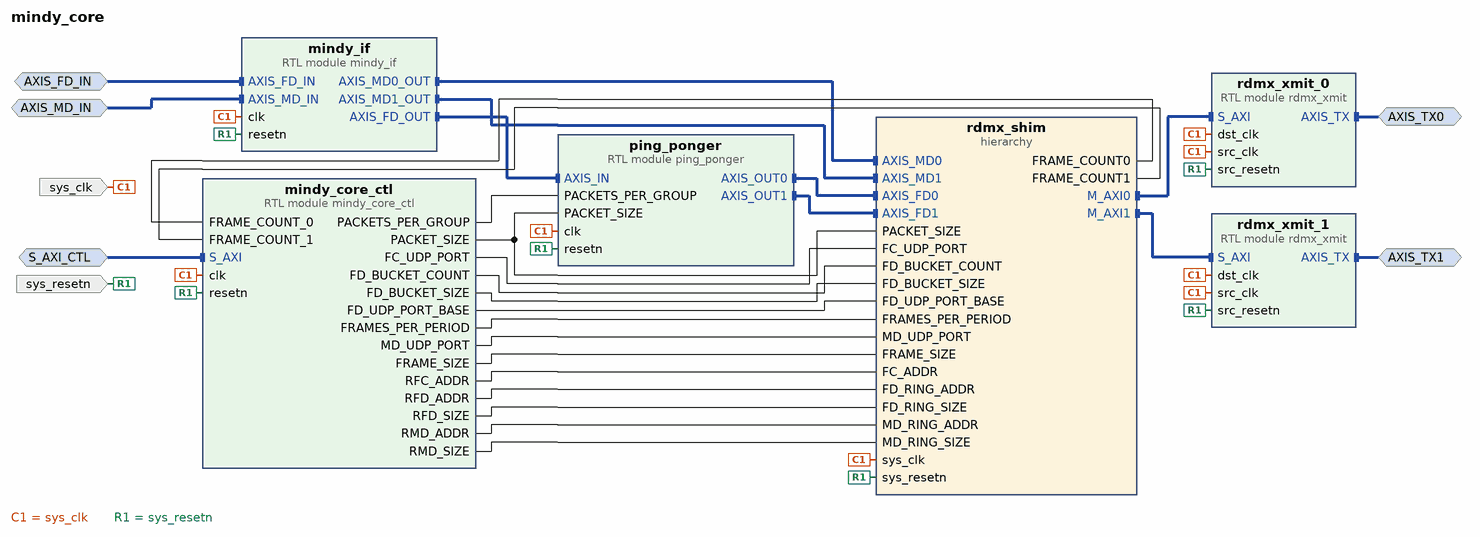
[diagram p0: block diagram of the top level]
# Vivado block design mindy_core, xcvp1202-vsva2785-2MP-e-S, Vivado 2024.2
create_bd_design mindy_core

create_bd_intf_port -mode Slave -vlnv xilinx.com:interface:axis_rtl:1.0 AXIS_FD_IN
set_property -dict [list \
  CONFIG.FREQ_HZ 250000000 \
  CONFIG.HAS_TKEEP 0 \
  CONFIG.HAS_TLAST 0 \
  CONFIG.HAS_TREADY 1 \
  CONFIG.HAS_TSTRB 0 \
  CONFIG.LAYERED_METADATA undef \
  CONFIG.TDATA_NUM_BYTES 64 \
  CONFIG.TDEST_WIDTH 0 \
  CONFIG.TID_WIDTH 0 \
  CONFIG.TUSER_WIDTH 0 \
] [get_bd_intf_ports AXIS_FD_IN]
create_bd_intf_port -mode Slave -vlnv xilinx.com:interface:aximm_rtl:1.0 S_AXI_CTL
set_property -dict [list \
  CONFIG.ADDR_WIDTH 32 \
  CONFIG.ARUSER_WIDTH 0 \
  CONFIG.AWUSER_WIDTH 0 \
  CONFIG.BUSER_WIDTH 0 \
  CONFIG.DATA_WIDTH 32 \
  CONFIG.FREQ_HZ 250000000 \
  CONFIG.HAS_BRESP 1 \
  CONFIG.HAS_BURST 0 \
  CONFIG.HAS_CACHE 0 \
  CONFIG.HAS_LOCK 0 \
  CONFIG.HAS_PROT 1 \
  CONFIG.HAS_QOS 0 \
  CONFIG.HAS_REGION 0 \
  CONFIG.HAS_RRESP 1 \
  CONFIG.HAS_WSTRB 1 \
  CONFIG.ID_WIDTH 0 \
  CONFIG.NUM_READ_OUTSTANDING 1 \
  CONFIG.NUM_READ_THREADS 1 \
  CONFIG.NUM_WRITE_OUTSTANDING 1 \
  CONFIG.NUM_WRITE_THREADS 1 \
  CONFIG.PROTOCOL AXI4LITE \
  CONFIG.READ_WRITE_MODE READ_WRITE \
  CONFIG.RUSER_BITS_PER_BYTE 0 \
  CONFIG.RUSER_WIDTH 0 \
  CONFIG.WUSER_BITS_PER_BYTE 0 \
  CONFIG.WUSER_WIDTH 0 \
] [get_bd_intf_ports S_AXI_CTL]
create_bd_intf_port -mode Master -vlnv xilinx.com:interface:axis_rtl:1.0 AXIS_TX0
set_property -dict {CONFIG.FREQ_HZ 250000000} [get_bd_intf_ports AXIS_TX0]
create_bd_intf_port -mode Master -vlnv xilinx.com:interface:axis_rtl:1.0 AXIS_TX1
set_property -dict {CONFIG.FREQ_HZ 250000000} [get_bd_intf_ports AXIS_TX1]
create_bd_intf_port -mode Slave -vlnv xilinx.com:interface:axis_rtl:1.0 AXIS_MD_IN
set_property -dict [list \
  CONFIG.FREQ_HZ 250000000 \
  CONFIG.HAS_TKEEP 0 \
  CONFIG.HAS_TLAST 0 \
  CONFIG.HAS_TREADY 1 \
  CONFIG.HAS_TSTRB 0 \
  CONFIG.LAYERED_METADATA undef \
  CONFIG.TDATA_NUM_BYTES 64 \
  CONFIG.TDEST_WIDTH 0 \
  CONFIG.TID_WIDTH 0 \
  CONFIG.TUSER_WIDTH 0 \
] [get_bd_intf_ports AXIS_MD_IN]
create_bd_port -dir I sys_resetn
create_bd_port -dir I -type clk sys_clk
set_property -dict [list \
  CONFIG.ASSOCIATED_BUSIF AXIS_FD_IN:S_AXI_CTL:AXIS_MD_IN:AXIS_TX0:AXIS_TX1 \
  CONFIG.FREQ_HZ 250000000 \
] [get_bd_ports sys_clk]

create_bd_cell -type hier rdmx_shim
create_bd_cell -type module -reference ping_ponger ping_ponger
create_bd_cell -type module -reference mindy_if mindy_if
create_bd_cell -type module -reference mindy_core_ctl mindy_core_ctl
create_bd_cell -type module -reference rdmx_xmit rdmx_xmit_0
set_property -dict {CONFIG.FIFO_CLOCK_MODE common_clock CONFIG.SRC_MAC 0} [get_bd_cells rdmx_xmit_0]
create_bd_cell -type module -reference rdmx_xmit rdmx_xmit_1
set_property -dict {CONFIG.FIFO_CLOCK_MODE common_clock CONFIG.SRC_MAC 1} [get_bd_cells rdmx_xmit_1]

# ---- hierarchy /rdmx_shim ----
current_bd_instance /rdmx_shim
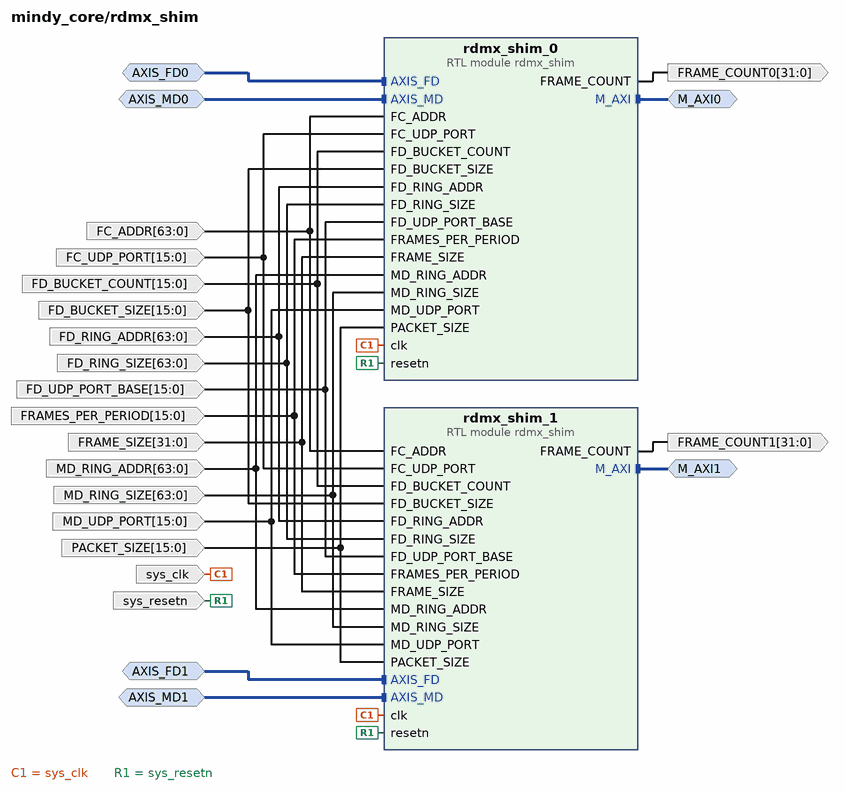
[diagram p1: block diagram inside /rdmx_shim]
create_bd_intf_pin -mode Slave -vlnv xilinx.com:interface:axis_rtl:1.0 AXIS_FD1
create_bd_intf_pin -mode Slave -vlnv xilinx.com:interface:axis_rtl:1.0 AXIS_MD1
create_bd_intf_pin -mode Master -vlnv xilinx.com:interface:aximm_rtl:1.0 M_AXI1
create_bd_intf_pin -mode Slave -vlnv xilinx.com:interface:axis_rtl:1.0 AXIS_FD0
create_bd_intf_pin -mode Slave -vlnv xilinx.com:interface:axis_rtl:1.0 AXIS_MD0
create_bd_intf_pin -mode Master -vlnv xilinx.com:interface:aximm_rtl:1.0 M_AXI0
create_bd_pin -dir I sys_clk
create_bd_pin -dir I sys_resetn
create_bd_pin -dir O -from 31 -to 0 FRAME_COUNT1
create_bd_pin -dir I -from 15 -to 0 PACKET_SIZE
create_bd_pin -dir I -from 31 -to 0 FRAME_SIZE
create_bd_pin -dir I -from 63 -to 0 FD_RING_ADDR
create_bd_pin -dir I -from 63 -to 0 FD_RING_SIZE
create_bd_pin -dir I -from 63 -to 0 MD_RING_ADDR
create_bd_pin -dir I -from 63 -to 0 MD_RING_SIZE
create_bd_pin -dir I -from 63 -to 0 FC_ADDR
create_bd_pin -dir O -from 31 -to 0 FRAME_COUNT0
create_bd_pin -dir I -from 15 -to 0 MD_UDP_PORT
create_bd_pin -dir I -from 15 -to 0 FC_UDP_PORT
create_bd_pin -dir I -from 15 -to 0 FD_UDP_PORT_BASE
create_bd_pin -dir I -from 15 -to 0 FRAMES_PER_PERIOD
create_bd_pin -dir I -from 15 -to 0 FD_BUCKET_COUNT
create_bd_pin -dir I -from 15 -to 0 FD_BUCKET_SIZE

create_bd_cell -type module -reference rdmx_shim rdmx_shim_1
create_bd_cell -type module -reference rdmx_shim rdmx_shim_0

# ---- connections ----

current_bd_instance /rdmx_shim
connect_bd_intf_net -intf_net AXIS_FD0_1 [get_bd_intf_pins AXIS_FD0] [get_bd_intf_pins rdmx_shim_0/AXIS_FD]
connect_bd_intf_net -intf_net AXIS_FD1_1 [get_bd_intf_pins AXIS_FD1] [get_bd_intf_pins rdmx_shim_1/AXIS_FD]
connect_bd_intf_net -intf_net AXIS_MD0_1 [get_bd_intf_pins AXIS_MD0] [get_bd_intf_pins rdmx_shim_0/AXIS_MD]
connect_bd_intf_net -intf_net AXIS_MD1_1 [get_bd_intf_pins AXIS_MD1] [get_bd_intf_pins rdmx_shim_1/AXIS_MD]
connect_bd_intf_net [get_bd_intf_pins M_AXI0] [get_bd_intf_pins rdmx_shim_0/M_AXI]
connect_bd_intf_net [get_bd_intf_pins M_AXI1] [get_bd_intf_pins rdmx_shim_1/M_AXI]
connect_bd_net [get_bd_pins FC_ADDR] [get_bd_pins rdmx_shim_0/FC_ADDR] [get_bd_pins rdmx_shim_1/FC_ADDR]
connect_bd_net [get_bd_pins FC_UDP_PORT] [get_bd_pins rdmx_shim_0/FC_UDP_PORT] [get_bd_pins rdmx_shim_1/FC_UDP_PORT]
connect_bd_net [get_bd_pins FD_BUCKET_COUNT] [get_bd_pins rdmx_shim_0/FD_BUCKET_COUNT] [get_bd_pins rdmx_shim_1/FD_BUCKET_COUNT]
connect_bd_net [get_bd_pins FD_BUCKET_SIZE] [get_bd_pins rdmx_shim_0/FD_BUCKET_SIZE] [get_bd_pins rdmx_shim_1/FD_BUCKET_SIZE]
connect_bd_net [get_bd_pins FD_RING_ADDR] [get_bd_pins rdmx_shim_0/FD_RING_ADDR] [get_bd_pins rdmx_shim_1/FD_RING_ADDR]
connect_bd_net [get_bd_pins FD_RING_SIZE] [get_bd_pins rdmx_shim_0/FD_RING_SIZE] [get_bd_pins rdmx_shim_1/FD_RING_SIZE]
connect_bd_net [get_bd_pins FD_UDP_PORT_BASE] [get_bd_pins rdmx_shim_0/FD_UDP_PORT_BASE] [get_bd_pins rdmx_shim_1/FD_UDP_PORT_BASE]
connect_bd_net [get_bd_pins FRAMES_PER_PERIOD] [get_bd_pins rdmx_shim_0/FRAMES_PER_PERIOD] [get_bd_pins rdmx_shim_1/FRAMES_PER_PERIOD]
connect_bd_net [get_bd_pins FRAME_SIZE] [get_bd_pins rdmx_shim_0/FRAME_SIZE] [get_bd_pins rdmx_shim_1/FRAME_SIZE]
connect_bd_net [get_bd_pins MD_RING_ADDR] [get_bd_pins rdmx_shim_0/MD_RING_ADDR] [get_bd_pins rdmx_shim_1/MD_RING_ADDR]
connect_bd_net [get_bd_pins MD_RING_SIZE] [get_bd_pins rdmx_shim_0/MD_RING_SIZE] [get_bd_pins rdmx_shim_1/MD_RING_SIZE]
connect_bd_net [get_bd_pins MD_UDP_PORT] [get_bd_pins rdmx_shim_0/MD_UDP_PORT] [get_bd_pins rdmx_shim_1/MD_UDP_PORT]
connect_bd_net [get_bd_pins PACKET_SIZE] [get_bd_pins rdmx_shim_0/PACKET_SIZE] [get_bd_pins rdmx_shim_1/PACKET_SIZE]
connect_bd_net [get_bd_pins rdmx_shim_0/FRAME_COUNT] [get_bd_pins FRAME_COUNT0]
connect_bd_net [get_bd_pins rdmx_shim_1/FRAME_COUNT] [get_bd_pins FRAME_COUNT1]
connect_bd_net [get_bd_pins sys_clk] [get_bd_pins rdmx_shim_0/clk] [get_bd_pins rdmx_shim_1/clk]
connect_bd_net [get_bd_pins sys_resetn] [get_bd_pins rdmx_shim_0/resetn] [get_bd_pins rdmx_shim_1/resetn]

current_bd_instance /
connect_bd_intf_net [get_bd_intf_pins mindy_if/AXIS_FD_IN] [get_bd_intf_ports AXIS_FD_IN]
connect_bd_intf_net [get_bd_intf_pins mindy_if/AXIS_MD_IN] [get_bd_intf_ports AXIS_MD_IN]
connect_bd_intf_net [get_bd_intf_pins mindy_core_ctl/S_AXI] [get_bd_intf_ports S_AXI_CTL]
connect_bd_intf_net [get_bd_intf_pins mindy_if/AXIS_FD_OUT] [get_bd_intf_pins ping_ponger/AXIS_IN]
connect_bd_intf_net [get_bd_intf_pins mindy_if/AXIS_MD0_OUT] [get_bd_intf_pins rdmx_shim/AXIS_MD0]
connect_bd_intf_net [get_bd_intf_pins mindy_if/AXIS_MD1_OUT] [get_bd_intf_pins rdmx_shim/AXIS_MD1]
connect_bd_intf_net -intf_net ping_ponger_0_AXIS_OUT0 [get_bd_intf_pins ping_ponger/AXIS_OUT0] [get_bd_intf_pins rdmx_shim/AXIS_FD0]
connect_bd_intf_net -intf_net ping_ponger_0_AXIS_OUT1 [get_bd_intf_pins ping_ponger/AXIS_OUT1] [get_bd_intf_pins rdmx_shim/AXIS_FD1]
connect_bd_intf_net [get_bd_intf_pins rdmx_xmit_0/S_AXI] [get_bd_intf_pins rdmx_shim/M_AXI0]
connect_bd_intf_net [get_bd_intf_pins rdmx_xmit_1/S_AXI] [get_bd_intf_pins rdmx_shim/M_AXI1]
connect_bd_intf_net [get_bd_intf_pins rdmx_xmit_0/AXIS_TX] [get_bd_intf_ports AXIS_TX0]
connect_bd_intf_net [get_bd_intf_pins rdmx_xmit_1/AXIS_TX] [get_bd_intf_ports AXIS_TX1]
connect_bd_net -net FC_UDP_PORT_1 [get_bd_pins mindy_core_ctl/FC_UDP_PORT] [get_bd_pins rdmx_shim/FC_UDP_PORT]
connect_bd_net -net FD_BUCKET_COUNT_1 [get_bd_pins mindy_core_ctl/FD_BUCKET_COUNT] [get_bd_pins rdmx_shim/FD_BUCKET_COUNT]
connect_bd_net -net FD_BUCKET_SIZE_1 [get_bd_pins mindy_core_ctl/FD_BUCKET_SIZE] [get_bd_pins rdmx_shim/FD_BUCKET_SIZE]
connect_bd_net -net FD_UDP_PORT_BASE_1 [get_bd_pins mindy_core_ctl/FD_UDP_PORT_BASE] [get_bd_pins rdmx_shim/FD_UDP_PORT_BASE]
connect_bd_net -net FRAMES_PER_PERIOD_1 [get_bd_pins mindy_core_ctl/FRAMES_PER_PERIOD] [get_bd_pins rdmx_shim/FRAMES_PER_PERIOD]
connect_bd_net -net MD_UDP_PORT_1 [get_bd_pins mindy_core_ctl/MD_UDP_PORT] [get_bd_pins rdmx_shim/MD_UDP_PORT]
connect_bd_net -net mindy_core_ctl_0_FRAME_SIZE [get_bd_pins mindy_core_ctl/FRAME_SIZE] [get_bd_pins rdmx_shim/FRAME_SIZE]
connect_bd_net -net mindy_core_ctl_0_PACKET_SIZE [get_bd_pins mindy_core_ctl/PACKET_SIZE] \
  [get_bd_pins rdmx_shim/PACKET_SIZE] [get_bd_pins ping_ponger/PACKET_SIZE]
connect_bd_net -net mindy_core_ctl_0_RFC_ADDR [get_bd_pins mindy_core_ctl/RFC_ADDR] [get_bd_pins rdmx_shim/FC_ADDR]
connect_bd_net -net mindy_core_ctl_0_RFD_ADDR [get_bd_pins mindy_core_ctl/RFD_ADDR] [get_bd_pins rdmx_shim/FD_RING_ADDR]
connect_bd_net -net mindy_core_ctl_0_RFD_SIZE [get_bd_pins mindy_core_ctl/RFD_SIZE] [get_bd_pins rdmx_shim/FD_RING_SIZE]
connect_bd_net -net mindy_core_ctl_0_RMD_ADDR [get_bd_pins mindy_core_ctl/RMD_ADDR] [get_bd_pins rdmx_shim/MD_RING_ADDR]
connect_bd_net -net mindy_core_ctl_0_RMD_SIZE [get_bd_pins mindy_core_ctl/RMD_SIZE] [get_bd_pins rdmx_shim/MD_RING_SIZE]
connect_bd_net [get_bd_pins mindy_core_ctl/PACKETS_PER_GROUP] [get_bd_pins ping_ponger/PACKETS_PER_GROUP]
connect_bd_net [get_bd_pins rdmx_shim/FRAME_COUNT0] [get_bd_pins mindy_core_ctl/FRAME_COUNT_0]
connect_bd_net [get_bd_pins rdmx_shim/FRAME_COUNT1] [get_bd_pins mindy_core_ctl/FRAME_COUNT_1]
connect_bd_net [get_bd_ports sys_clk] \
  [get_bd_pins rdmx_shim/sys_clk] [get_bd_pins mindy_core_ctl/clk] [get_bd_pins mindy_if/clk] [get_bd_pins ping_ponger/clk] \
  [get_bd_pins rdmx_xmit_0/src_clk] [get_bd_pins rdmx_xmit_0/dst_clk] [get_bd_pins rdmx_xmit_1/src_clk] \
  [get_bd_pins rdmx_xmit_1/dst_clk]
connect_bd_net [get_bd_ports sys_resetn] \
  [get_bd_pins rdmx_shim/sys_resetn] [get_bd_pins mindy_core_ctl/resetn] [get_bd_pins mindy_if/resetn] \
  [get_bd_pins ping_ponger/resetn] [get_bd_pins rdmx_xmit_0/src_resetn] [get_bd_pins rdmx_xmit_1/src_resetn]

# ---- address map ----
assign_bd_address -offset 0x0000000000000000 -range 16E -target_address_space [get_bd_addr_spaces rdmx_shim/rdmx_shim_0/M_AXI] [get_bd_addr_segs rdmx_xmit_0/S_AXI/reg0]
assign_bd_address -offset 0x0000000000000000 -range 16E -target_address_space [get_bd_addr_spaces rdmx_shim/rdmx_shim_1/M_AXI] [get_bd_addr_segs rdmx_xmit_1/S_AXI/reg0]
assign_bd_address -offset 0x00000000 -range 4K -target_address_space [get_bd_addr_spaces S_AXI_CTL] [get_bd_addr_segs mindy_core_ctl/S_AXI/reg0]

validate_bd_design
save_bd_design
